# EasyEDA Pro project 2025智能物流搬运_PCB_XAUT_20250927.eprj, schematic Schematic16_1
Board Name: 塔吊综合板_1.2; Create Date: 2025-02-27; Page Name: P1; Project Name: 2025智能物流搬运_PCB_XAUT_20250921; Schematic Name: Schematic16; Update Date: 2025-02-27; Company: 嘉立创EDA; Page Size: A4; Version: V1.0
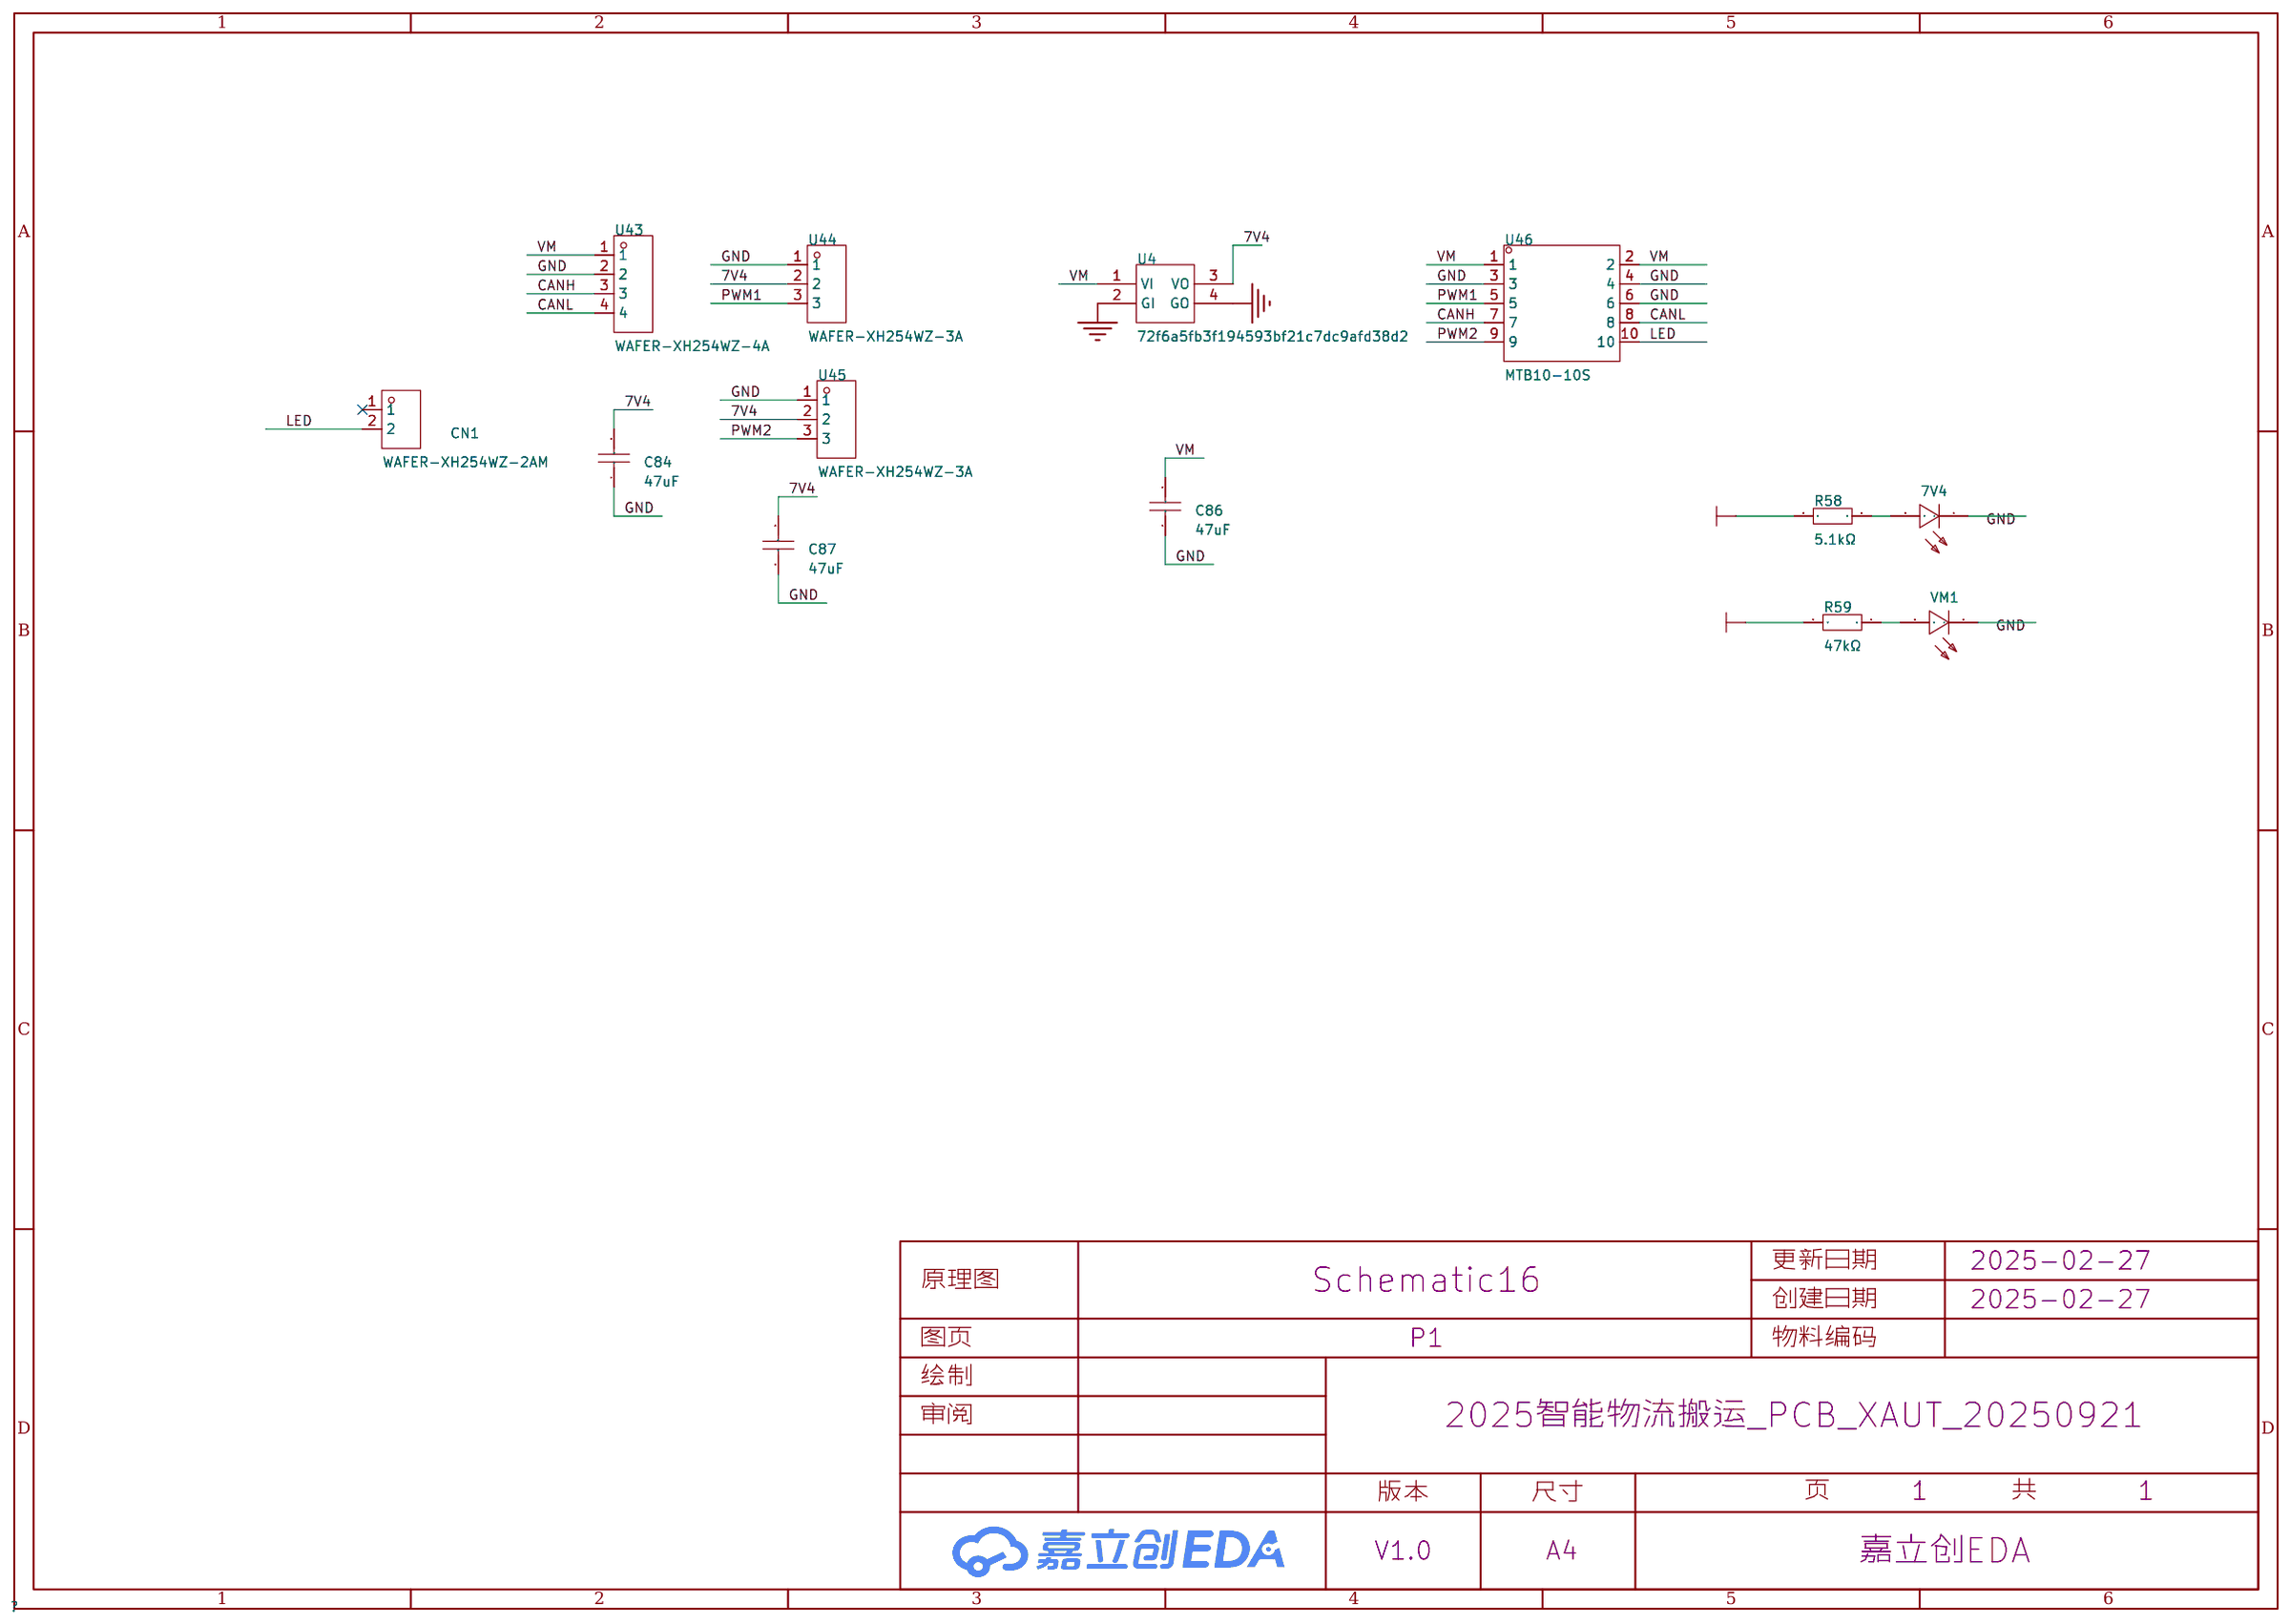
[diagram p12: schematic sheet]

## Parts
7V4  FC-DA1608HRK-620D  [LED0603-RD_RED]
C84  47uF  [C1206]
C86  47uF  [C1206]
C87  47uF  [C1206]
CN1  WAFER-XH254WZ-2AM  [CONN-TH_2P-P2.50_WAFER-XH254WZ-2A]
R58  5.1kΩ  [R0603]
R59  47kΩ  [R0603]
U4  72f6a5fb3f194593bf21c7dc9afd38d2  [5V降压模块_17.5*12]
U43  WAFER-XH254WZ-4A  [conn-th_4p-p2.50_wafer-xh254wz-4a]
U44  WAFER-XH254WZ-3A  [CONN-TH_WAFER-XH254WZ-3A]
U45  WAFER-XH254WZ-3A  [CONN-TH_WAFER-XH254WZ-3A]
U46  MTB10-10S  [IDC-TH_MTB110-10S]
VM1  FC-DA1608HRK-620D  [LED0603-RD_RED]

## Library data of the parts
7V4 VM1 = FC-DA1608HRK-620D: link: https://item.szlcsc.com/221679.html; Supplier: LCSC; Manufacturer: 国星光电; Manufacturer Part: NCD0603R1; Supplier Part: C84263; JLCPCB Part Class: Extended Part
C84 C86 C87 = 1206B103K500NT: LCSC Part Name: 10nF ±10% 50V; Supplier Part: C1846; Manufacturer: FH(风华); Supplier Footprint: 1206; JLCPCB Part Class: 基础库; Datasheet: https://atta.szlcsc.com/upload/public/pdf/source/20200305/C486355_26A10D38EF8C2A5C37091D0039909270.pdf; Supplier: LCSC; Tolerance: ±10%; Voltage Rated: 50V; Temperature Coefficient: X7R
CN1 = WAFER-XH254WZ-2AM: LCSC Part Name: XH弯针2P 耐高温米色; Supplier Part: C22751831; Manufacturer: HANBO(汉博); Supplier Footprint: 弯插,P=2.54mm; JLCPCB Part Class: 扩展库; Datasheet: https://atta.szlcsc.com/upload/public/pdf/source/20240628/71AFBAED85796F20BDCD3F107152AF3A.pdf; Supplier: LCSC
R58 R59 = 2kΩ: link: https://www.mouser.in/datasheet/2/447/PYu_RT_1_to_0_01_RoHS_L_11-1669912.pdf; Supplier: LCSC; Manufacturer: UNI-ROYAL(厚声); Manufacturer Part: 0603WAF2001T5E; Supplier Part: C22975; JLCPCB Part Class: Basic Part
U4 = 5V降压模块_17.5*12
U43 = WAFER-XH254WZ-4A: Supplier Part: C7432693; Manufacturer: HANBO(汉博); Supplier Footprint: 插件,P=2.5mm; Datasheet: https://atta.szlcsc.com/upload/public/pdf/source/20230721/127D646758C1D4B76FEF9901992220E1.pdf; Supplier: LCSC; Pins Structure: 1x4P; Pitch: 2.54mm; Mounting Style: 弯插; Reference Series: XH; Number of Pins: 4P; Number of Rows: 1; Number of PINs Per Row: 4; Current Rating (Max): 3A; Operating Temperature Range: -25℃~+85℃
U44 U45 = WAFER-XH254WZ-3A: Supplier Part: C7432692; Manufacturer: HANBO(汉博); Supplier Footprint: 插件,P=2.5mm; Datasheet: https://atta.szlcsc.com/upload/public/pdf/source/20230721/127D646758C1D4B76FEF9901992220E1.pdf; Supplier: LCSC; Pins Structure: 1x3P; Pitch: 2.54mm; Mounting Style: 弯插; Reference Series: XH; Number of Pins: 3P; Number of Rows: 1; Number of PINs Per Row: 3; Current Rating (Max): 3A; Operating Temperature Range: -25℃~+85℃
U46 = MTB10-10S: LCSC Part Name: 2.54mm 2x5P 排数:2 每排P数:5; Supplier Part: C358743; Manufacturer: MINTRON(明硕); Supplier Footprint: 插件,P=2.54mm; JLCPCB Part Class: 扩展库; Datasheet: https://atta.szlcsc.com/upload/public/pdf/source/20190124/C358750_E3578BC2367A1528391A7216FECD5344.pdf; Supplier: LCSC; Connector Type: 简牛座; Pitch: 2.54mm; Structure: 2x5P; Holder Type: 直插; Row Spacing: 2.54mm; Number of Rows: 2; Pin Number in each Row: 5; Contact Material: 黄铜

## Nets
7V4: C84.2 C87.2 R58.2 U4.3(VO) U44.2 U45.2
GND: 7V4.1(K) C84.1 C86.1 C87.1 U4.2(GI) U4.4(GO) U43.2 U44.1 U45.1 U46.3 U46.4 U46.6 VM1.1(K)
CANH: U43.3 U46.7
CANL: U43.4 U46.8
LED: CN1.2 U46.10
PWM1: U44.3 U46.5
PWM2: U45.3 U46.9
VM: C86.2 R59.2 U4.1(VI) U43.1 U46.1 U46.2
$1N712: R59.1 VM1.2(A)
$1N728: 7V4.2(A) R58.1

Not connected (* = marked no-connect by the designer): CN1 1*
